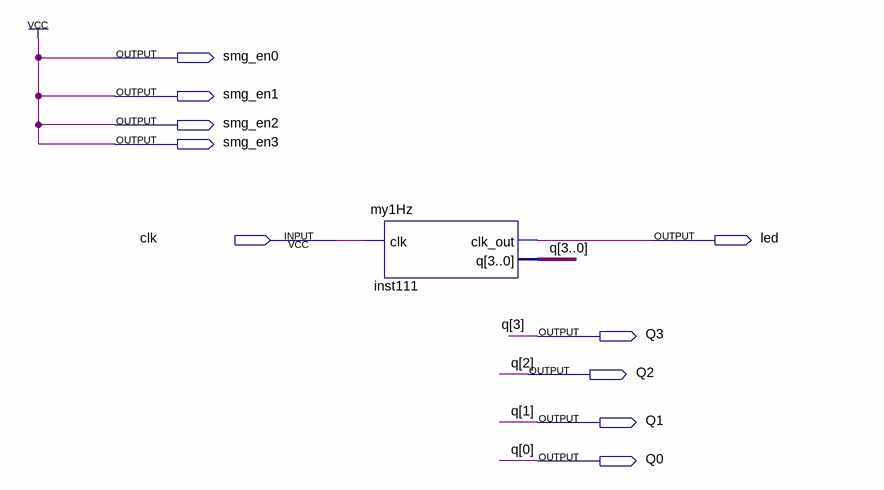
[diagram p0: schematic sheet]
// Quartus schematic mydisp.bdf as structural Verilog: 1 symbols, 10 pins
module mydisp (
  input  clk,
  output smg_en0,
  output smg_en1,
  output smg_en2,
  output smg_en3,
  output led,
  output Q3,
  output Q2,
  output Q1,
  output Q0
);

  my1Hz inst111 (.clk(clk), .clk_out(led), .q({Q3, Q2, Q1, Q0}));

  assign smg_en0 = 1'b1;
  assign smg_en1 = 1'b1;
  assign smg_en2 = 1'b1;
  assign smg_en3 = 1'b1;
endmodule
